# EAGLE design ClockSure (EAGLE 6.3)
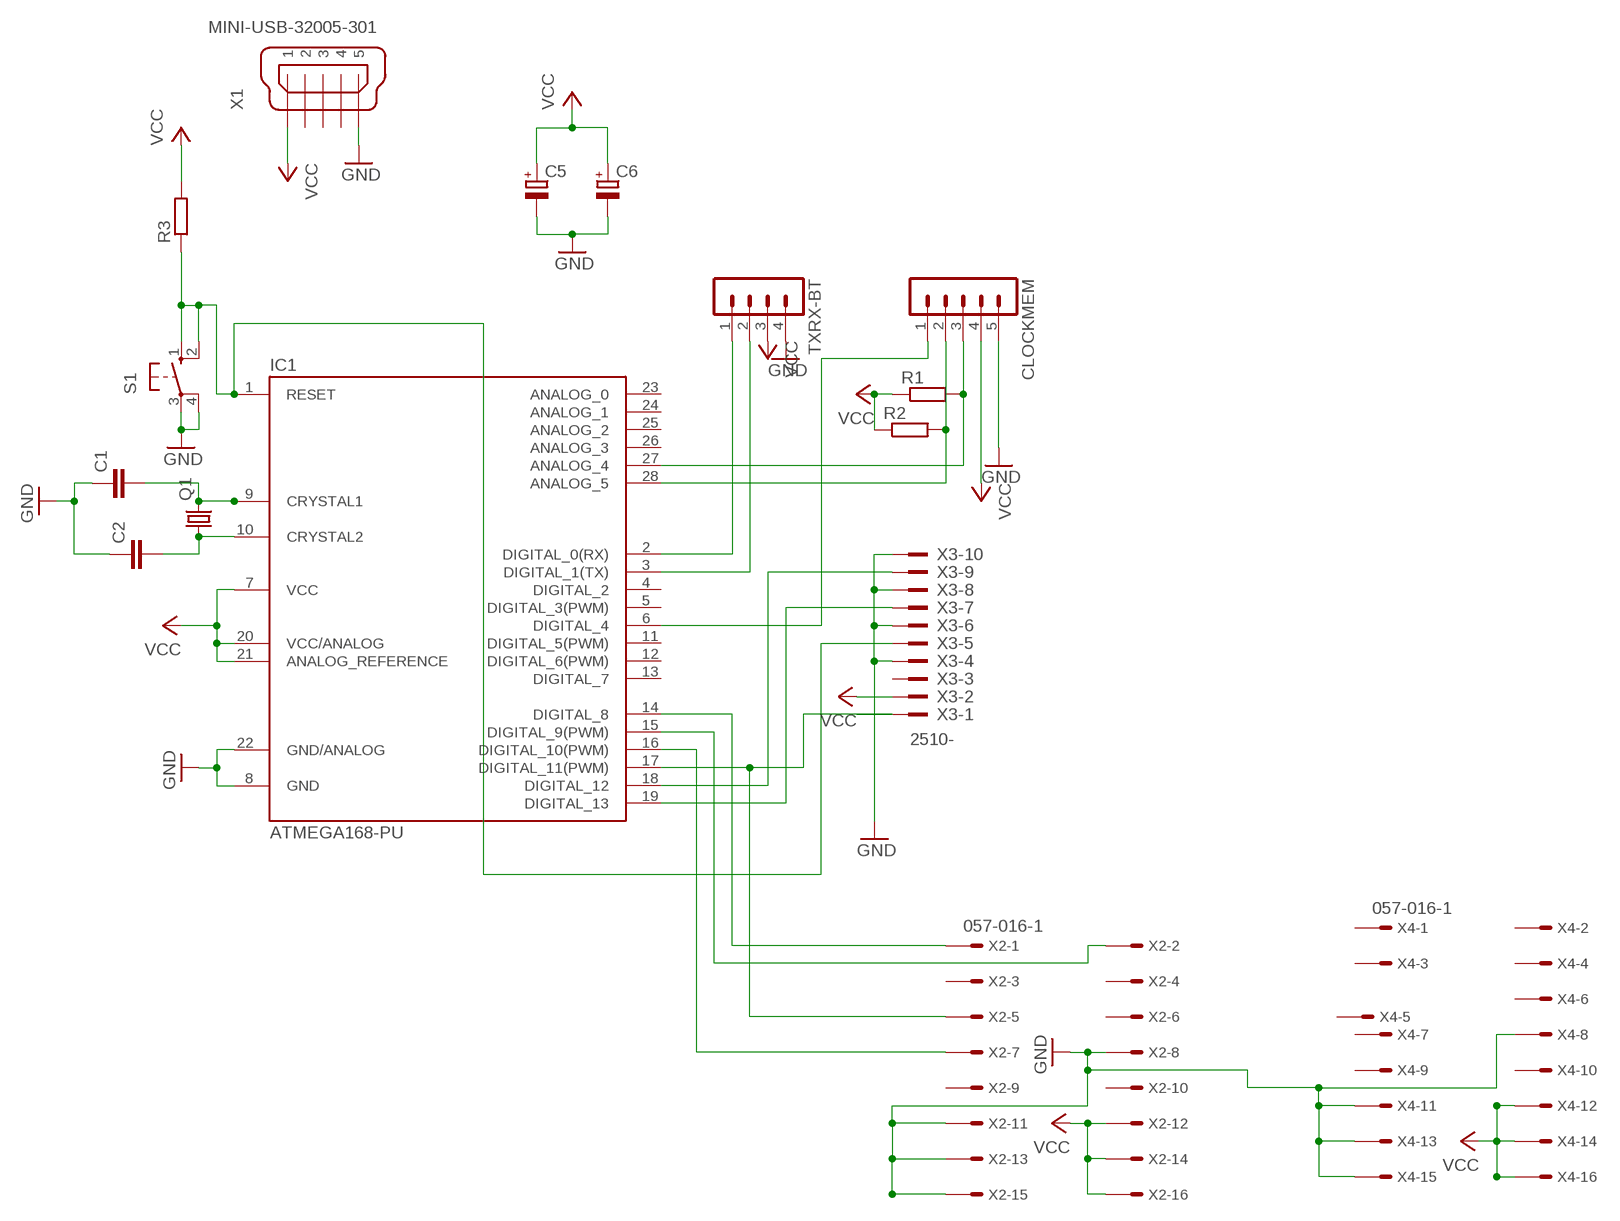
[diagram p0: schematic, sheet 1]

## Parts
C1  C-EU025-030X050  [C025-030X050]
C2  C-EU025-030X050  [C025-030X050]
C5  CPOL-EUE2.5-6  [E2,5-6]
C6  CPOL-EUE2.5-6  [E2,5-6]
CLOCKMEM  MA05-1  [MA05-1]
IC1  ATMEGA168-PU  [DIL28-3]
Q1  CRYSTALHC49U70  [HC49U70]
R1  R-EU_0207/10  [0207/10]
R2  R-EU_0207/10  [0207/10]
R3  R-EU_0207/10  [0207/10]
S1  10-XX  [B3F-10XX]
TXRX-BT  MA04-1  [MA04-1]
X1  MINI-USB-32005-301  [32005-301]
X2  057-016-1  [057-016-1]
X3  2510-  [PAK100/2500-10]
X4  057-016-1  [057-016-1]

## Nets
GND: C1.1 C2.1 C5.- C6.- CLOCKMEM.5 IC1.8(GND) IC1.22(GND/ANALOG) S1.3(P) S1.4(P1) TXRX-BT.4 X1.5 X2.8 X2.11 X2.13 X2.15 X3.4 X3.6 X3.8 X3.10 X4.8 X4.11 X4.13 X4.15
N$1: C1.2 IC1.9(CRYSTAL1) Q1.2
N$2: C2.2 IC1.10(CRYSTAL2) Q1.1
N$3: IC1.2(DIGITAL_0(RX)) TXRX-BT.1
N$4: IC1.3(DIGITAL_1(TX)) TXRX-BT.2
N$5: CLOCKMEM.2 IC1.28(ANALOG_5) R2.2
N$6: IC1.1(RESET) R3.1 S1.1(S) S1.2(S1) X3.5
N$7: CLOCKMEM.3 IC1.27(ANALOG_4) R1.2
N$8: IC1.18(DIGITAL_12) X3.9
N$9: IC1.19(DIGITAL_13) X3.7
N$10: IC1.17(DIGITAL_11(PWM)) X2.5 X3.1
N$11: IC1.15(DIGITAL_9(PWM)) X2.2
N$12: IC1.14(DIGITAL_8) X2.1
N$13: CLOCKMEM.1 IC1.6(DIGITAL_4)
N$14: IC1.16(DIGITAL_10(PWM)) X2.7
VCC: C5.+ C6.+ CLOCKMEM.4 IC1.7(VCC) IC1.20(VCC/ANALOG) IC1.21(ANALOG_REFERENCE) R1.1 R2.1 R3.2 TXRX-BT.3 X1.1 X2.12 X2.14 X2.16 X3.2 X4.12 X4.14 X4.16
Unconnected: IC1.4(DIGITAL_2) IC1.5(DIGITAL_3(PWM)) IC1.11(DIGITAL_5(PWM)) IC1.12(DIGITAL_6(PWM)) IC1.13(DIGITAL_7) IC1.23(ANALOG_0) IC1.24(ANALOG_1) IC1.25(ANALOG_2) IC1.26(ANALOG_3) X1.2 X1.3 X1.4 X2.3 X2.4 X2.6 X2.9 X2.10 X3.3 X4.1 X4.2 X4.3 X4.4 X4.5 X4.6 X4.7 X4.9 X4.10

## Library data of the parts
C1 C2 = rcl:C-EU: CAPACITOR, European symbol
C5 C6 = rcl:CPOL-EU: POLARIZED CAPACITOR, European symbol
CLOCKMEM = con-lstb:MA05-1: PIN HEADER; OC_FARNELL: unknown; OC_NEWARK: unknown
IC1 = Arduino-AVR:ATMEGA168-PU
Q1 = crystal:CRYSTAL: CRYSTAL; OC_FARNELL: unknown; OC_NEWARK: unknown
R1-R3 = rcl:R-EU_: RESISTOR, European symbol
S1 = switch-omron:10-XX: OMRON SWITCH; MPN: B3F-1000; OC_FARNELL: 176432; OC_NEWARK: 36M3542
TXRX-BT = con-lstb:MA04-1: PIN HEADER; OC_FARNELL: unknown; OC_NEWARK: unknown
X1 = con-cypressindustries:MINI-USB-: MINI USB-B Conector Source: www.cypressindustries.com; OC_FARNELL: unknown; OC_NEWARK: unknown
X2 X4 = con-panduit:057-016-: CONNECTOR 10-pin series 057 contact pc board low profile headers; OC_FARNELL: unknown; OC_NEWARK: unknown
X3 = con-3m:2510-: 3M (TM) Pak 100 4-Wall Header Source: 3M; MF: 3M; MPN: 2510-6002UB; OC_FARNELL: 9838244; OC_NEWARK: 46F4725

## Board
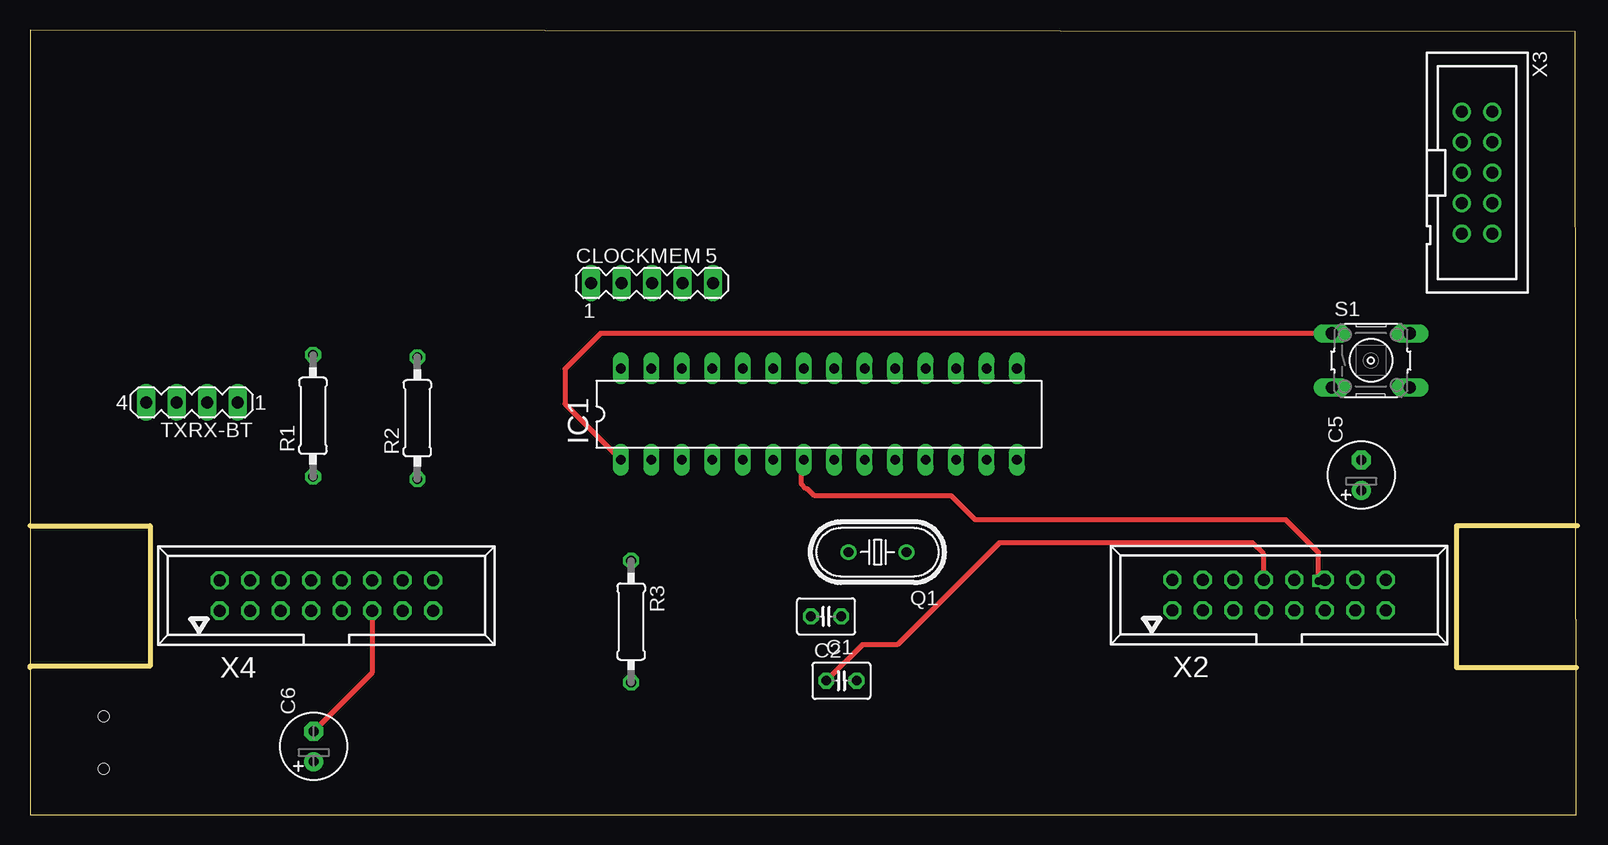
[diagram p1: board, top side]
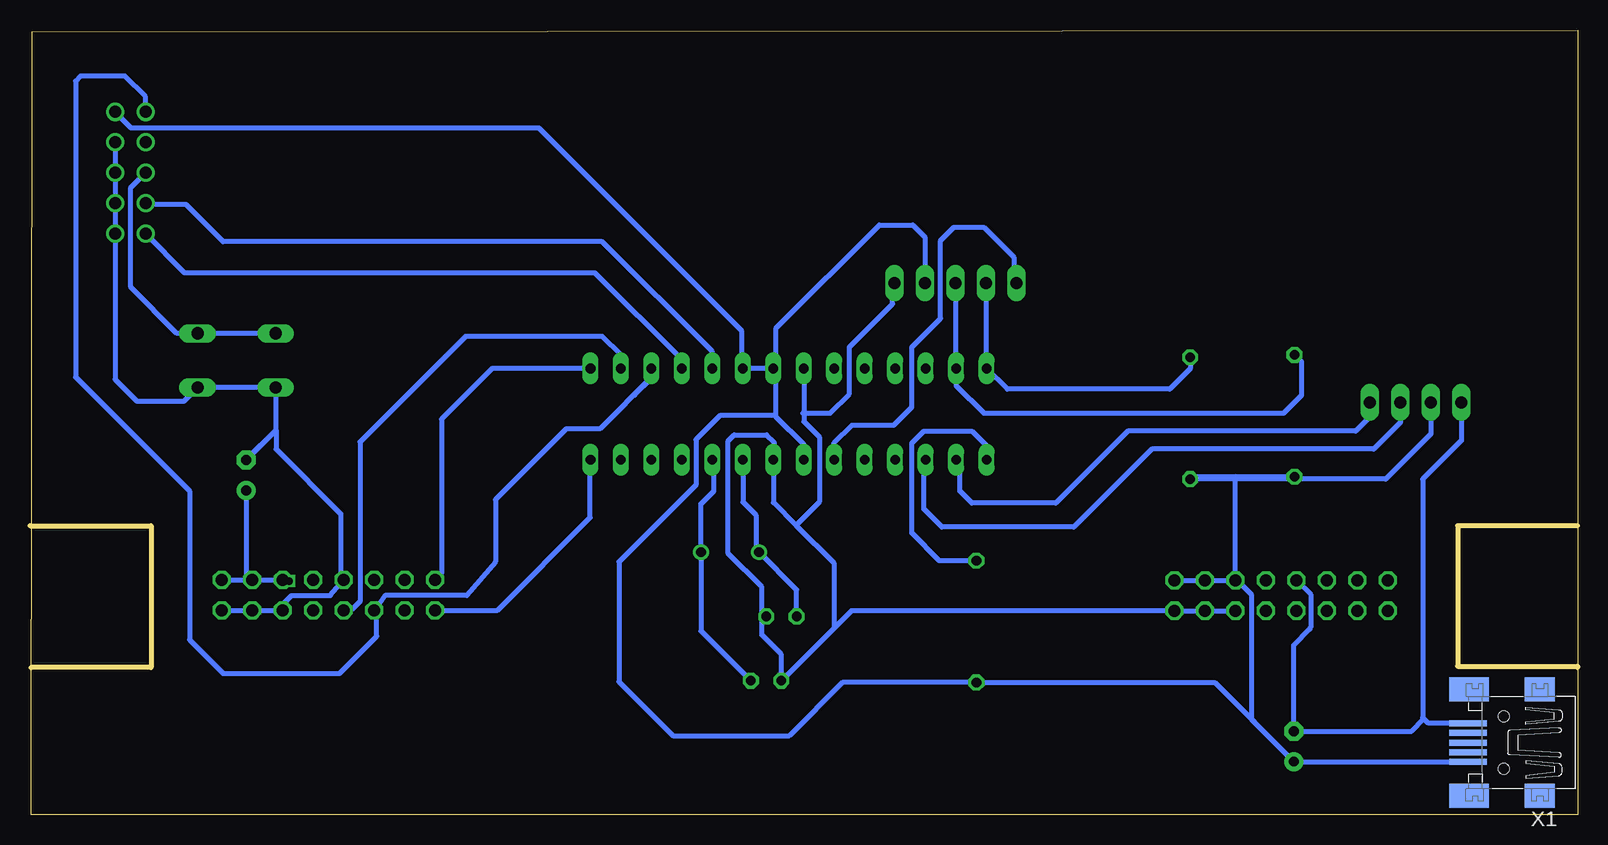
[diagram p2: board, bottom side, seen from below]

Size 129 x 65.45 mm. Coordinates in mm from the lower left corner, seen from the top.
Outline: 0,24.1 0,65.45 128.83,65.32 128.9,0 0,0 0,12.3
Outline: 0,24.1 0,12.3
Outline: 0,24.1 10,24.1 10,12.4 0,12.4 0,12.3
Outline: 129,24.1 118.9,24.1 118.9,12.3 128.9,12.3
Copper layers (1*16): Top 0.035mm / dielectric 1.5mm / Bottom 0.035mm
Design rules "default": minimum track width 10mil, minimum drill 24mil, track to track 8mil, track to pad 8mil, pad to pad 8mil, via to via 8mil, smd to smd 8mil, copper to edge 40mil, drill to drill 8mil, minimum pad ring 10mil, minimum via ring 8mil, stop-mask expansion 4mil, vias tented up to drill 0mil, thermal gap 10mil

### Footprints (pad centres in the part's own frame; a part is rotated, then mirrored left to right if it is on the bottom)
C025-030X050 = drill 0.813 octagon: 1 -1.27,0; 2 1.27,0
E2,5-6 = drill 0.813 pad 1.6: + -1.27,0 | drill 0.813 pad 1.6 octagon: - 1.27,0
MA05-1 = drill 1.016 long: 1 -5.08,0; 2 -2.54,0; 3 0,0; 4 2.54,0; 5 5.08,0
DIL28-3 = drill 0.813 long: 1 -16.51,-3.81; 2 -13.97,-3.81; 3 -11.43,-3.81; 4 -8.89,-3.81; 5 -6.35,-3.81; 6 -3.81,-3.81; 7 -1.27,-3.81; 8 1.27,-3.81; 9 3.81,-3.81; 10 6.35,-3.81; 11 8.89,-3.81; 12 11.43,-3.81; 13 13.97,-3.81; 14 16.51,-3.81; 15 16.51,3.81; 16 13.97,3.81; 17 11.43,3.81; 18 8.89,3.81; 19 6.35,3.81; 20 3.81,3.81; 21 1.27,3.81; 22 -1.27,3.81; 23 -3.81,3.81; 24 -6.35,3.81; 25 -8.89,3.81; 26 -11.43,3.81; 27 -13.97,3.81; 28 -16.51,3.81
HC49U70 = drill 0.813: 1 -2.413,0; 2 2.413,0
0207/10 = drill 0.813 octagon: 1 -5.08,0; 2 5.08,0
B3F-10XX = drill 1.016 long: 1 -3.251,2.261; 2 3.251,2.261; 3 -3.251,-2.261; 4 3.251,-2.261
MA04-1 = drill 1.016 long: 1 -3.81,0; 2 -1.27,0; 3 1.27,0; 4 3.81,0
32005-301 = smd 3.1 x 0.5: 1 3,1.6; 2 3,0.8; 3 3,0; 4 3,-0.8; 5 3,-1.6 | smd 2.5 x 2: M1 -3,-4.45; M2 -3,4.45 | smd 3.3 x 2: M3 2.9,4.45; M4 2.9,-4.45 | hole 0.9: 0,2.2; 0,-2.2
057-016-1 = drill 1 octagon: 1 -8.89,-1.27; 2 -8.89,1.27; 3 -6.35,-1.27; 4 -6.35,1.27; 5 -3.81,-1.27; 6 -3.81,1.27; 7 -1.27,-1.27; 8 -1.27,1.27; 9 1.27,-1.27; 10 1.27,1.27; 11 3.81,-1.27; 12 3.81,1.27; 13 6.35,-1.27; 14 6.35,1.27; 15 8.89,-1.27; 16 8.89,1.27
PAK100/2500-10 = drill 1 pad 1.422: 1 -5.08,-1.27; 2 -5.08,1.27; 3 -2.54,-1.27; 4 -2.54,1.27; 5 0,-1.27; 6 0,1.27; 7 2.54,-1.27; 8 2.54,1.27; 9 5.08,-1.27; 10 5.08,1.27

### Placement (x,y rotation side)
C1  66.36,16.55 180 top
C2  67.64,11.19 0 top
C5  110.97,28.33 90 top
C6  23.65,5.71 90 top
CLOCKMEM  51.85,44.35 0 top
IC1  65.77,33.42 0 top
Q1  70.65,21.91 180 top
R1  23.59,33.28 90 top
R2  32.29,33.08 90 top
R3  50.11,16.12 270 top
S1  111.78,37.89 0 top
TXRX-BT  13.49,34.4 180 top
X1  6.13,6.03 180 bottom
X2  104.12,18.34 0 top
X3  120.64,53.54 270 top
X4  24.7,18.3 0 top

### Tracks (layer width: path | path; a pad name or v marks a point on that pad's centre or on a via)
GND
  Top 0.406: X4.11 28.51,11.84 C6.- | X2.8 102.85,21.75 101.9,22.7 80.8,22.7 72.3,14.2 69.38,14.2 C2.1
  Bottom 0.406: TXRX-BT.4 9.68,31.22 12.9,28 12.9,8.1 12.8,8 | 12.8,8 12.5,7.7 9.2,7.7 X1.5 | 12.8,8 13.82,6.98 C6.- 23.65,14.15 22.3,15.5 22.3,15.6 22.2,15.7 22.2,18.34 X4.8 | X4.11 X4.13 X4.15 60.53,17.03 C2.1 | C2.1 66.37,13.37 68,15 68,16.18 | 68,16.18 C1.1 | IC1.8 67.04,26.04 65.15,24.15 | 65.15,24.15 62,21 62,15.56 C2.1 | X3.4 X3.6 X3.8 X3.10 121.91,36.31 120.1,34.5 116.16,34.5 S1.4 S1.3 108.53,32.04 C5.- 110.97,29.63 108.5,32.1 108.5,30.5 103.1,25.1 103.1,19.86 X2.8 103.96,18.3 107.2,18.3 107.93,17.57 X2.11 X2.13 X2.15 | 68,16.18 68,19 70.8,21.8 70.8,31.2 70.3,31.7 67.6,31.7 67,31.1 67,29.7 67.2,29.5 67.2,29.6 | 67.2,29.8 67.2,29.6 | 67.2,29.6 67.1,29.5 | 65.15,24.15 63.2,26.1 63.2,31.5 64.5,32.8 IC1.22 64.5,33.6 64.6,33.5 62.3,33.5 60.7,35.1 60.7,39 57.1,42.6 57.1,44.18 CLOCKMEM.5
N$1
  Bottom 0.406: IC1.9 69.58,26.08 68.5,25 68.5,22.17 Q1.2 65.09,18.76 C1.2
N$2
  Bottom 0.406: IC1.10 72,29.49 72,27 73.06,25.94 Q1.1 73.06,15.34 C2.2
N$3
  Bottom 0.406: TXRX-BT.1 17.3,33.2 18.5,32 37.5,32 43.5,26 50.5,26 51.5,27 51.5,29.31 IC1.2
N$4
  Bottom 0.406: TXRX-BT.2 14.76,32.74 17,30.5 35.5,30.5 42,24 53,24 54.5,25.5 54.5,29.45 IC1.3
N$5
  Bottom 0.406: R2.2 32.29,37.21 34,35.5 47.53,35.5 IC1.28 49.31,37.28 CLOCKMEM.2
N$6
  Top 0.406: S1.1 47.55,40.15 44.6,37.2 44.6,34.27 IC1.1
  Bottom 0.406: R3.1 53.2,21.2 55.5,23.5 55.5,31 54.5,32 50.5,32 49,30.5 49,29.87 IC1.1 | S1.1 S1.2 116.75,40.15 120.6,44 120.6,52.31 X3.5 119.37,53.43
N$7
  Bottom 0.406: R1.2 23,37.77 23,35 24.5,33.5 49.5,33.5 51.8,35.8 IC1.27 51.85,37.28 CLOCKMEM.3
N$8
  Bottom 0.406: IC1.18 74.66,37.96 81.9,45.2 116.11,45.2 X3.9
N$9
  Bottom 0.406: IC1.19 72.12,38.62 81.3,47.8 112.9,47.8 116,50.9 119.27,50.9 X3.7
N$10
  Bottom 0.406: 78.6,35 77.2,36.4 IC1.17 77.2,36.5 81.5,32.2 84.3,32.2 90.2,26.3 90.2,21.1 92.6,18.3 99.4,18.3 99.9,17.6 99.9,17.48 X2.5 100.1,16.86 100.1,14.9 103.2,11.8 112.9,11.8 115.7,14.6 115.7,27 125.2,36.5 125.2,61.2 124.8,61.6 121.1,61.6 119.37,59.87 X3.1
N$11
  Bottom 0.406: IC1.15 90.47,37.23 94.7,33 94.7,20.14 X2.2
N$12
  Bottom 0.406: X2.1 90.03,17.07 82.3,24.8 82.3,29.59 IC1.14
N$13
  Bottom 0.406: IC1.6 61.96,31.04 60.5,32.5 57,32.5 55.5,34 55.5,39 53.1,41.4 53.1,47.9 52,49 49.5,49 47,46.5 47,44.58 CLOCKMEM.1
N$14
  Bottom 0.406: IC1.16 79.74,38.34 81.3,39.9 92.7,39.9 101.5,31.1 101.5,17.8 102.2,17.1 102.82,17.1 X2.7
VCC  (via drill 0.6)
  Top 0.406: v107.4,19.5 107.4,21.9 104.7,24.6 78.8,24.6 76.8,26.6 65.4,26.6 64.8,27.2 64.7,27.2 64.3,27.6 64.3,29.41 IC1.7
  Bottom 0.406: C6.+ X1.1 | X4.16 X4.14 X4.12 | X4.12 28.51,28.22 R2.1 | X4.12 28.37,19.57 27.2,18.4 27.2,7.99 C6.+ | TXRX-BT.3 12.22,31.78 16,28 R2.1 | R1.1 32.09,28.2 R2.1 | C6.+ 30.25,11.04 R3.2 61.26,11.04 65.7,6.6 75.4,6.6 79.9,11.1 79.9,21.1 73.5,27.5 73.5,31.3 71.5,33.3 66.9,33.3 66.8,33.2 | X2.16 X2.14 | X2.14 X2.12 | X2.12 107.51,19.61 v107.4,19.5 107.82,19.5 X2.12 | 66.8,33.2 64.5,30.9 IC1.7 | 66.8,33.2 66.8,36.99 | 66.8,36.99 IC1.21 IC1.20 69.7,37.35 69.7,40.4 85.85,56.55 86.54,57.24 86.6,57.3 120.6,57.3 X3.2 | 66.8,36.99 66.8,40.6 58.2,49.2 55.4,49.2 54.4,48.2 CLOCKMEM.4 | C5.+ 110.97,20.11 X2.14